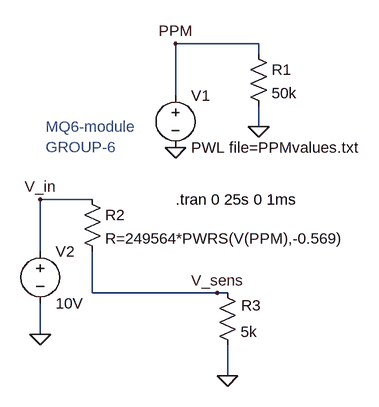
[diagram p0: schematic MQ6-sensor.asc]
MQ6-sensor.asc, the LTspice schematic file:
Version 4
SHEET 1 880 680
WIRE 528 -160 400 -160
WIRE 528 -144 528 -160
WIRE 400 -80 400 -160
WIRE 528 -32 528 -64
WIRE 272 80 192 80
WIRE 192 160 192 80
WIRE 272 224 272 160
WIRE 464 224 272 224
WIRE 480 224 464 224
WIRE 192 288 192 240
WIRE 480 352 480 304
FLAG 192 288 0
FLAG 480 352 0
FLAG 528 -32 0
FLAG 400 0 0
FLAG 400 -160 PPM
FLAG 192 80 V_in
FLAG 464 224 V_sens
SYMBOL res 512 -160 R0
SYMATTR InstName R1
SYMATTR Value 50k
SYMBOL voltage 400 -96 R0
WINDOW 123 0 0 Left 0
WINDOW 39 0 0 Left 0
SYMATTR InstName V1
SYMATTR Value PWL file=PPMvalues.txt
SYMBOL voltage 192 144 R0
WINDOW 123 0 0 Left 0
WINDOW 39 0 0 Left 0
SYMATTR InstName V2
SYMATTR Value 10V
SYMBOL res 256 64 R0
SYMATTR InstName R2
SYMATTR Value R=249564*PWRS(V(PPM),-0.569)
SYMBOL res 464 208 R0
WINDOW 0 37 35 Left 2
SYMATTR InstName R3
SYMATTR Value 5k
TEXT 400 80 Left 2 !.tran 0 25s 0 1ms
TEXT 200 -32 Left 2 ;MQ6-module\nGROUP-6

The netlist it stands for:
* MQ6-sensor.asc
R1 PPM 0 50k
V1 PPM 0 PWL file=PPMvalues.txt
V2 V_in 0 10V
R2 V_in V_sens R=249564*PWRS(V(PPM),-0.569)
R3 V_sens 0 5k
.tran 0 25s 0 1ms
* MQ6-module
* GROUP-6
.backanno
.end